# Altium schematic sheet APM32F103RCT6核心板原理图.SchDoc
size A4
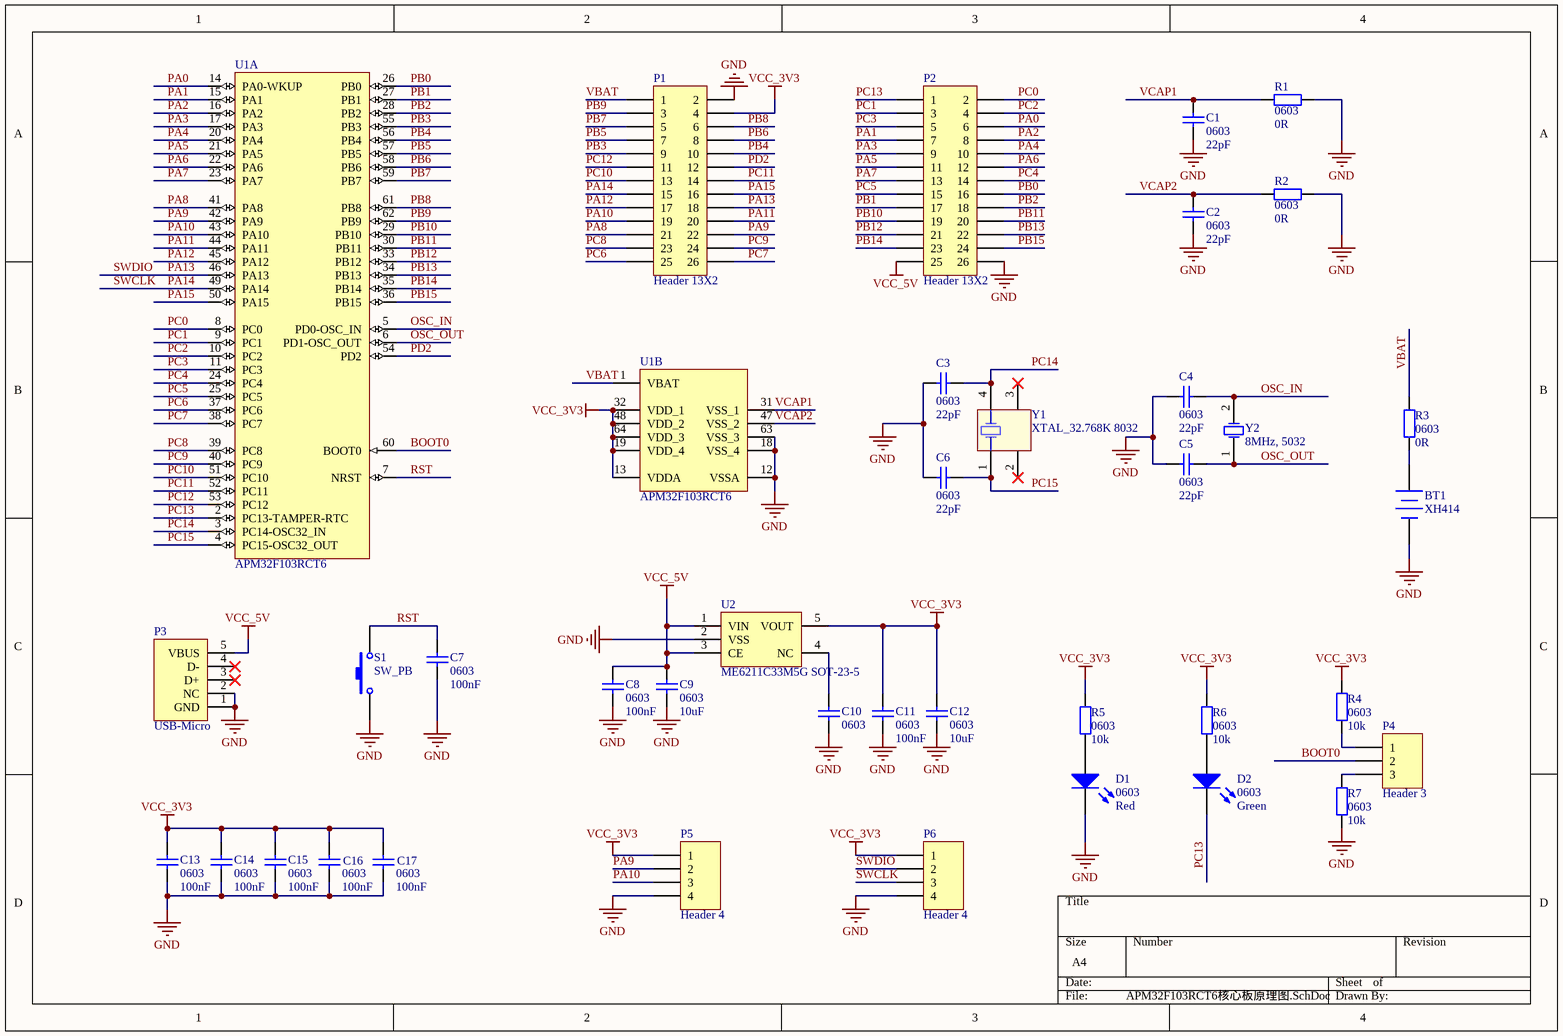
[diagram p0: APM32F103RCT6核心板原理图.SchDoc]

## Parts
BT1  XH414  [XH414]
C1  value 22pF  footprint: 0603  [R0603-R/C-Y]  (hidden comment: Cap 0603)
C2  value 22pF  footprint: 0603  [R0603-R/C-Y]  (hidden comment: Cap 0603)
C3  value 22pF  footprint: 0603  [R0603-R/C-Y]  (hidden comment: Cap 0603)
C4  value 22pF  footprint: 0603  [R0603-R/C-Y]  (hidden comment: Cap 0603)
C5  value 22pF  footprint: 0603  [R0603-R/C-Y]  (hidden comment: Cap 0603)
C6  value 22pF  footprint: 0603  [R0603-R/C-Y]  (hidden comment: Cap 0603)
C7  value 100nF  footprint: 0603  [R0603-R/C-Y]  (hidden comment: Cap 0603)
C8  value 100nF  footprint: 0603  [R0603-R/C-Y]  (hidden comment: Cap 0603)
C9  value 10uF  footprint: 0603  [R0603-R/C-Y]  (hidden comment: Cap 0603)
C10  footprint: 0603  [R0603-R/C-Y]  (hidden comment: Cap 0603)
C11  value 100nF  footprint: 0603  [R0603-R/C-Y]  (hidden comment: Cap 0603)
C12  value 10uF  footprint: 0603  [R0603-R/C-Y]  (hidden comment: Cap 0603)
C13  value 100nF  footprint: 0603  [R0603-R/C-Y]  (hidden comment: Cap 0603)
C14  value 100nF  footprint: 0603  [R0603-R/C-Y]  (hidden comment: Cap 0603)
C15  value 100nF  footprint: 0603  [R0603-R/C-Y]  (hidden comment: Cap 0603)
C16  value 100nF  footprint: 0603  [R0603-R/C-Y]  (hidden comment: Cap 0603)
C17  value 100nF  footprint: 0603  [R0603-R/C-Y]  (hidden comment: Cap 0603)
D1  value Red  Footprint: 0603  [0603-LED-G]  (hidden comment: LED 0603)
D2  value Green  Footprint: 0603  [0603-LED-G]  (hidden comment: LED 0603)
P1  Header 13X2  [HDR2X13]
P2  Header 13X2  [HDR2X13]
P3  USB-Micro  [USB Micro]
P4  Header 3  [HDR1X3]
P5  Header 4  [HDR1X4]
P6  Header 4  [HDR1X4]
R1  value 0R  Footprint: 0603  [R0603-R/C-BY]  (hidden comment: Res 0603)
R2  value 0R  Footprint: 0603  [R0603-R/C-BY]  (hidden comment: Res 0603)
R3  value 0R  Footprint: 0603  [R0603-R/C-BY]  (hidden comment: Res 0603)
R4  value 10k  Footprint: 0603  [R0603-R/C-BY]  (hidden comment: Res 0603)
R5  value 10k  Footprint: 0603  [R0603-R/C-BY]  (hidden comment: Res 0603)
R6  value 10k  Footprint: 0603  [R0603-R/C-BY]  (hidden comment: Res 0603)
R7  value 10k  Footprint: 0603  [R0603-R/C-BY]  (hidden comment: Res 0603)
S1  SW_PB  [SW-2Pin]
U1  APM32F103RCT6  [STM-LQFP64_M]  (parts A,B of 2)
U2  ME6211C33M5G SOT-23-5  [SOT-23-5]
Y1  XTAL_32.768K 8032  [XTAL_8032]
Y2  8MHz, 5032  [XTAL 5032]

## Nets
GND: BT1.2(-) C1.2 C2.2 C3.2 C4.2 C5.2 C6.2 C7.1 C8.1 C9.1 C10.1 C11.1 C12.1 C13.1 C14.1 C15.1 C16.1 C17.1 D1.2(K) P1.2 P2.26 P3.1(GND) P3.2(NC) P5.4 P6.4 R1.2 R2.2 R7.1 S1.1 U1.12(VSSA) U1.18(VSS_4) U1.63(VSS_3) U2.2(VSS)
VCC_3V3: C11.2 C12.2 C13.2 C14.2 C15.2 C16.2 C17.2 P1.4 P5.1 P6.1 R4.2 R5.1 R6.1 U1.13(VDDA) U1.19(VDD_4) U1.32(VDD_1) U1.48(VDD_2) U1.64(VDD_3) U2.5(VOUT)
VCC_5V: C8.2 C9.2 P2.25 P3.5(VBUS) U2.1(VIN) U2.3(CE)
BOOT0: P4.2 U1.60(BOOT0)
OSC_IN: C4.1 U1.5(PD0-OSC_IN) Y2.2(OSC2)
OSC_OUT: C5.1 U1.6(PD1-OSC_OUT) Y2.1(OSC1)
PA0: P2.6 U1.14(PA0-WKUP)
PA1: P2.7 U1.15(PA1)
PA2: P2.8 U1.16(PA2)
PA3: P2.9 U1.17(PA3)
PA4: P2.10 U1.20(PA4)
PA5: P2.11 U1.21(PA5)
PA6: P2.12 U1.22(PA6)
PA7: P2.13 U1.23(PA7)
PA8: P1.21 U1.41(PA8)
PA9: P1.22 P5.2 U1.42(PA9)
PA10: P1.19 P5.3 U1.43(PA10)
PA11: P1.20 U1.44(PA11)
PA12: P1.17 U1.45(PA12)
PA13: P1.18 P6.2 U1.46(PA13)  [also labelled SWDIO]
PA14: P1.15 P6.3 U1.49(PA14)  [also labelled SWCLK]
PA15: P1.16 U1.50(PA15)
PB0: P2.16 U1.26(PB0)
PB1: P2.17 U1.27(PB1)
PB2: P2.18 U1.28(PB2)
PB3: P1.9 U1.55(PB3)
PB4: P1.10 U1.56(PB4)
PB5: P1.7 U1.57(PB5)
PB6: P1.8 U1.58(PB6)
PB7: P1.5 U1.59(PB7)
PB8: P1.6 U1.61(PB8)
PB9: P1.3 U1.62(PB9)
PB10: P2.19 U1.29(PB10)
PB11: P2.20 U1.30(PB11)
PB12: P2.21 U1.33(PB12)
PB13: P2.22 U1.34(PB13)
PB14: P2.23 U1.35(PB14)
PB15: P2.24 U1.36(PB15)
PC0: P2.2 U1.8(PC0)
PC1: P2.3 U1.9(PC1)
PC2: P2.4 U1.10(PC2)
PC3: P2.5 U1.11(PC3)
PC4: P2.14 U1.24(PC4)
PC5: P2.15 U1.25(PC5)
PC6: P1.25 U1.37(PC6)
PC7: P1.26 U1.38(PC7)
PC8: P1.23 U1.39(PC8)
PC9: P1.24 U1.40(PC9)
PC10: P1.13 U1.51(PC10)
PC11: P1.14 U1.52(PC11)
PC12: P1.11 U1.53(PC12)
PC13: D2.2(K) P2.1 U1.2(PC13-TAMPER-RTC)
PC14: C3.1 U1.3(PC14-OSC32_IN) Y1.4(OSC2)
PC15: C6.1 U1.4(PC15-OSC32_OUT) Y1.1(OSC1)
PD2: P1.12 U1.54(PD2)
RST: C7.2 S1.2 U1.7(NRST)
VBAT: P1.1 R3.1 U1.1(VBAT)
VCAP1: C1.1 R1.1 U1.31(VSS_1)
VCAP2: C2.1 R2.1 U1.47(VSS_2)
NetBT1_1: BT1.1(+) R3.2
NetC10_2: C10.2 U2.4(NC)
NetD1_1: D1.1(A) R5.2
NetD2_1: D2.1(A) R6.2
NetP4_1: P4.1 R4.1
NetP4_3: P4.3 R7.2

Not connected (* = marked no-connect by the designer): P3 3(D+)* 4(D-)*; Y1 2(NC)* 3(NC)*

## Library data of the parts
BT1 = Battery: Multicell Battery; Published: 24-Mar-1999; LatestRevisionDate: 17-Jul-2002; LatestRevisionNote: Re-released for DXP Platform.; PackageReference: BAT-2; Publisher: Altium Limited; PackageDescription: Battery; 2 Leads
C1-C9 C11-C17 = Cap 0603: Capacitor 0603
C10 = Cap 0603: Capacitor 0603; value: 100nF
P1 P2 = Header 13X2: Header, 13-Pin, Dual row; LatestRevisionDate: 17-Jul-2002; LatestRevisionNote: Re-released for DXP Platform.; Publisher: Altium Limited
P4 = Header 3: Header, 3-Pin; LatestRevisionDate: 17-Jul-2002; LatestRevisionNote: Re-released for DXP Platform.; Publisher: Altium Limited
P5 P6 = Header 4: Header, 4-Pin; LatestRevisionDate: 17-Jul-2002; LatestRevisionNote: Re-released for DXP Platform.; Publisher: Altium Limited
R1-R7 = Res 0603: Resistor 0603
U1 = STM32F103RCT6: ARM Cortex-M3 32-bit MCU, 256 KB Flash, 48 KB Internal RAM, 51 I/Os, 64-pin LQFP, -40 to 85 degC, Tray; A/D Converter: 3x12-bit (16 Channel); D/A Converter: 2x12-bit (2 Channel); FLASH Size (Prog) (kB): 256; I/Os (High Current): 51; Internal RAM Size (kB): 48; Operating Frequency(F) (Processor speed) (MHz): 72; Supply Voltage(Vcc) min (V): 2; DatasheetVersion: Rev. 8; PackageVersion: Rev. 4, 06/2013; PackageReference: LQFP64; PackageDescription: 64-Pin Low Profile Quad Flat Package, 10 x 10 mm Body, 0.5 mm Pitch; Supplier 1: Digi-Key; Supplier Part Number 1: 497-9033-ND; Supplier 2: Newark; Supplier Part Number 2: 01P4099; Supplier 3: Newark; Supplier Part Number 3: 57P1227; Supplier 4: Mouser; Supplier Part Number 4: 511-STM32F103RCT6; Core: ARM Cortex-M3; Packing: Tray; Mounting Technology: Surface Mount; PartNumber: STM32F103RCT6; ComponentLink1Description: Manufacturer URL; ComponentLink1URL: http://www.st.com/web/en/home.html; ComponentLink2Description: Datasheet; ComponentLink2URL: http://www.st.com/st-web-ui/static/active/en/resource/technical/document/datasheet/CD00191185.pdf; ComponentLink3Description: Package Specification; ComponentLink3URL: http://www.st.com/st-web-ui/static/active/en/resource/technical/document/datasheet/DM00037051.pdf
U2 = ME6211C33M5G
Y2 = XTAL: Crystal Oscillator; Published: 8-Jun-2000; LatestRevisionDate: 17-Jul-2002; LatestRevisionNote: Re-released for DXP Platform.; Publisher: Altium Limited